# Altium schematic sheet Schematic.SchDoc
size C; SheetNumber: 1; SheetTotal: 1; SPICEModelCacheSRDWNHHB: <root> / <DocumentId>SRDWNHHB</DocumentId> / </root>
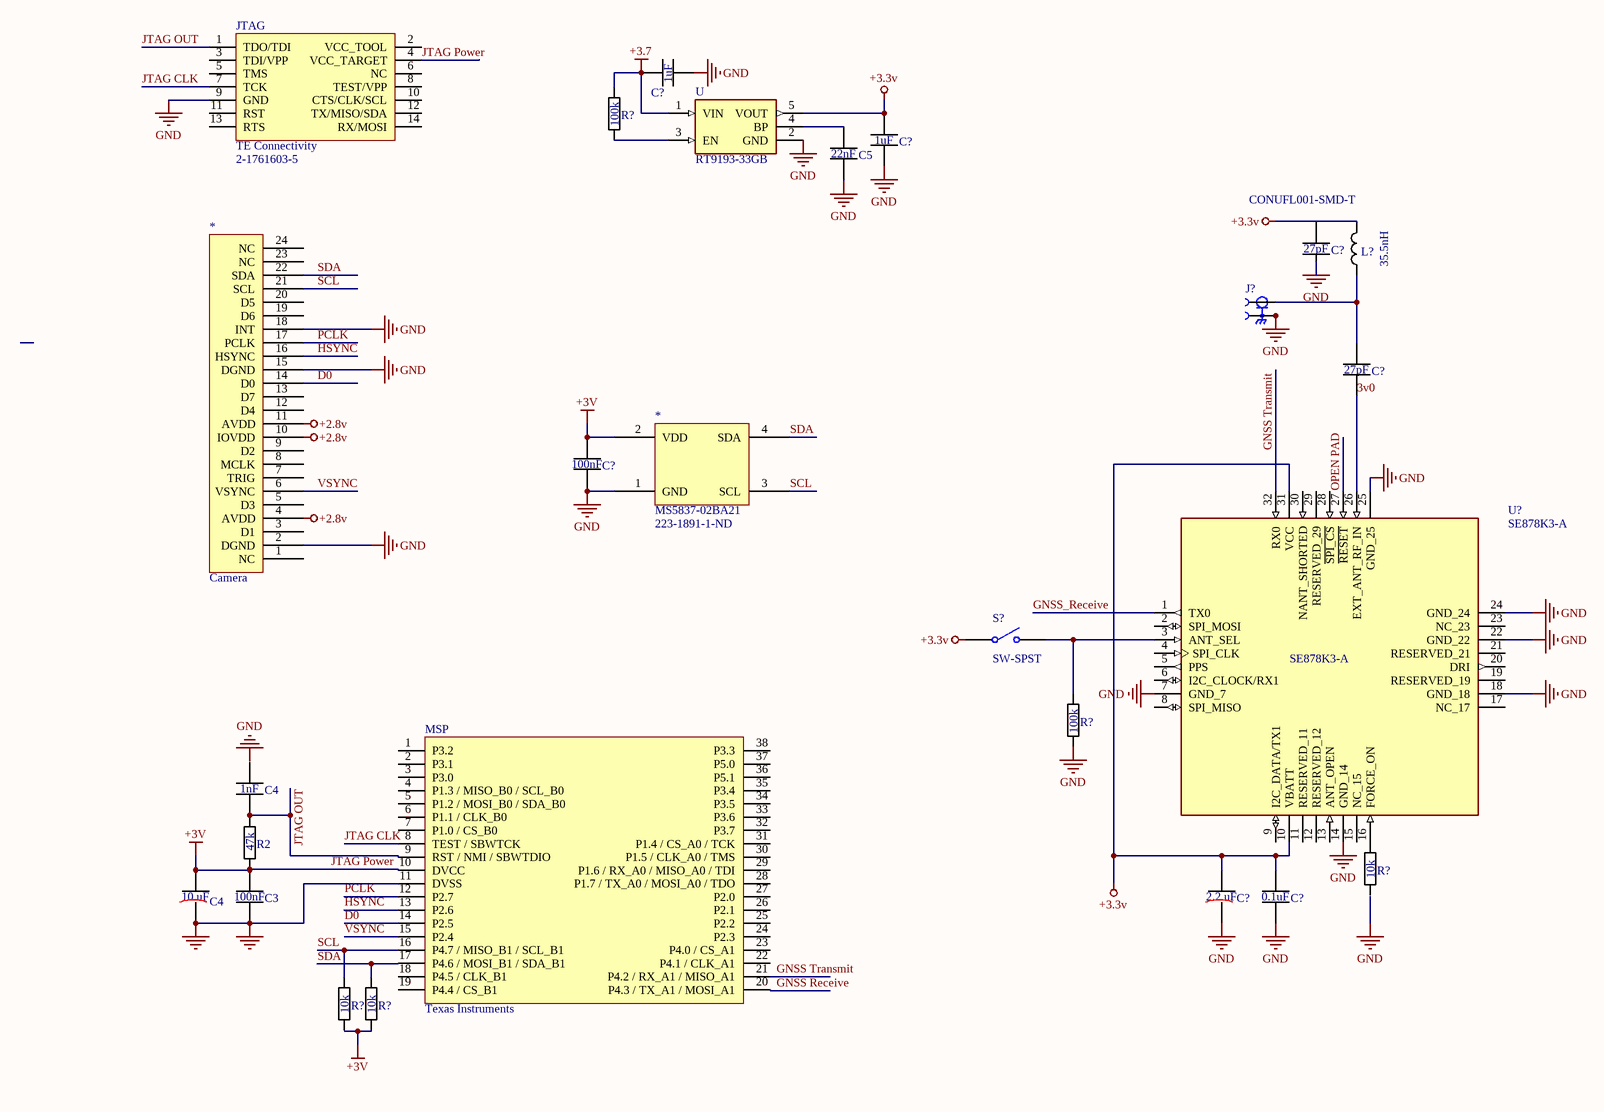
[diagram p0: Schematic.SchDoc]

## Parts
(Parts that share a designator on the sheet are numbered #1, #2 ... from top to bottom, then left to right.)
*#1  MS5837-02BA21  Supplier Part Number 1: 223-1891-1-ND
*#2  Camera
C3  value 100nF  [0805 (Capacitor)]  (hidden comment: C-u-002.200-10-0805)
C4#1  value 1nF  [0805 (Capacitor)]  (hidden comment: C-u-002.200-10-0805)
C4#2  value 10 uF  [0603 (Capacitor)]  (hidden comment: C-n-001.000-5-0603)
C5  value 22nF  [1210 (Capacitor)]  (hidden comment: C-u-022.000-10-1210)
C?#1  value 1uF  [0805 (Capacitor)]  (hidden comment: C-u-001.000-10-0805)
C?#2  value 1uF  [0805 (Capacitor)]  (hidden comment: C-u-001.000-10-0805)
C?#3  value 27pF  [0603 (Capacitor)]  (hidden comment: C-p-012.000-2-0603)
C?#4  value 27pF  [0603 (Capacitor)]  (hidden comment: C-p-012.000-2-0603)
C?#5  value 100nF  [0603 (Capacitor)]  (hidden comment: C-n-100.000-10-0603)
C?#6  value 2.2 uF  [0603 (Capacitor)]  (hidden comment: C-n-001.000-5-0603)
C?#7  value 0.1uF  [0805 (Capacitor)]  (hidden comment: C-u-002.200-10-0805)
J?  CONUFL001-SMD-T  [LINX_CONUFL001-SMD-T]
JTAG  Manufacturer: TE Connectivity  Manufucturer PartNo: 2-1761603-5  [TE 2-1761603-5]  (hidden comment: MSP430 Programming Header)
L?  value 35.5nH  [0805 (Inductor)]  (hidden comment: L-u-006.800-20-0603)
MSP  Manufacturer: Texas Instruments  [MSP430FR2355 38-TFSOP]  (hidden comment: MSP430FR2355 38-TFSOP)
R2  value 47k  [0603 (Resistor)]  (hidden comment: R-k-010.000-1-0603)
R?#1  value 100k  [0603 (Resistor)]  (hidden comment: R-k-100.000-1-0603)
R?#2  value 100k  [0603 (Resistor)]  (hidden comment: R-k-100.000-1-0603)
R?#3  value 10k  [0603 (Resistor)]  (hidden comment: R-k-010.000-1-0603)
R?#4  value 10k  [0603 (Resistor)]  (hidden comment: R-k-010.000-1-0603)
R?#5  value 10k  [0603 (Resistor)]  (hidden comment: R-k-010.000-1-0603)
S?  SW-SPST  [SPST-2]
U  RT9193-33GB  [SOT94P279X129-5N]
U?  SE878K3-A  [XCVR_SE878K3-A]

## Nets
+2.8v: *#2.4(AVDD) *#2.10(IOVDD) *#2.11(AVDD)
+3.3v: C?#2.1 C?#6.1 C?#7.1 L?.1 S?.1(COMMON) U.5(VOUT) U?.10(VBATT) U?.31(VCC)
+3.7: C?#1.1 R?#1.1 U.1(VIN)
GND: *#1.1(GND) *#2.2(DGND) *#2.15(DGND) *#2.18(INT) C5.2 C?#1.2 C?#2.2 C?#3.2 C?#5.2 C?#6.2 C?#7.2 J?.2 J?.3 JTAG.9(GND) R?#2.2 U.2(GND) U?.7(GND_7) U?.14(GND_14) U?.18(GND_18) U?.22(GND_22) U?.24(GND_24) U?.25(GND_25)
JTAG Power: *#1.2(VDD) C3.1 C4#2.1 C?#5.1 JTAG.4(VCC_TARGET) MSP.10(DVCC) R2.2 R?#5.2  [also labelled +3V]
VCC: C3.2 C4#2.2 MSP.11(DVSS)
3v0: C?#4.2 U?.26(EXT_ANT_RF_IN)
D0: *#2.14(D0) MSP.14(P2.5)
GNSS Receive: MSP.20(P4.3_/_TX_A1_/_MOSI_A1)
GNSS Transmit: MSP.21(P4.2_/_RX_A1_/_MISO_A1) U?.32(RX0)
GNSS_Receive: U?.1(TX0)
HSYNC: *#2.16(HSYNC) MSP.13(P2.6)
JTAG CLK: JTAG.7(TCK) MSP.8(TEST_/_SBWTCK)
JTAG OUT: C4#1.2 JTAG.1(TDO/TDI) MSP.9(RST_/_NMI_/_SBWTDIO) R2.1
OPEN PAD: U?.27(~{RESET})
PCLK: *#2.17(PCLK) MSP.12(P2.7)
SCL: *#1.3(SCL) *#2.21(SCL) MSP.16(P4.7_/_MISO_B1_/_SCL_B1) R?#4.1
SDA: *#1.4(SDA) *#2.22(SDA) MSP.17(P4.6_/_MOSI_B1_/_SDA_B1) R?#5.1
VSYNC: *#2.6(VSYNC) MSP.15(P2.4)
NetC5_1: C5.1 U.4(BP)
NetC?#4_1: C?#4.1 J?.1 L?.2
NetR?#1_2: R?#1.2 U.3(EN)
NetR?#2_1: R?#2.1 S?.2(NO) U?.3(ANT_SEL)
NetR?#3_1: R?#3.1 U?.16(FORCE_ON)

Not connected (* = marked no-connect by the designer): *#2 1(NC) 3(D1) 5(D3) 7(TRIG) 8(MCLK) 9(D2) 12(D4) 13(D7) 19(D6) 20(D5) 23(NC) 24(NC); C4#1 1; C?#3 1; JTAG 2(VCC_TOOL) 3(TDI/VPP) 5(TMS) 6(NC) 8(TEST/VPP) 10(CTS/CLK/SCL) 11(RST) 12(TX/MISO/SDA) 13(RTS) 14(RX/MOSI); MSP 1(P3.2) 2(P3.1) 3(P3.0) 4(P1.3_/_MISO_B0_/_SCL_B0) 5(P1.2_/_MOSI_B0_/_SDA_B0) 6(P1.1_/_CLK_B0) 7(P1.0_/_CS_B0) 18(P4.5_/_CLK_B1) 19(P4.4_/_CS_B1) 22(P4.1_/_CLK_A1) 23(P4.0_/_CS_A1) 24(P2.3) 25(P2.2) 26(P2.1) 27(P2.0) 28(P1.7_/_TX_A0_/_MOSI_A0_/_TDO) 29(P1.6_/_RX_A0_/_MISO_A0_/_TDI) 30(P1.5_/_CLK_A0_/_TMS) 31(P1.4_/_CS_A0_/_TCK) 32(P3.7) 33(P3.6) 34(P3.5) 35(P3.4) 36(P5.1) 37(P5.0) 38(P3.3); R?#3 2; R?#4 2; U? 2(SPI_MOSI) 4(SPI_CLK) 5(PPS) 6(I2C_CLOCK/RX1) 8(SPI_MISO) 9(I2C_DATA/TX1) 11(RESERVED_11) 12(RESERVED_12) 13(ANT_OPEN) 15(NC_15) 17(NC_17) 19(RESERVED_19) 20(DRI) 21(RESERVED_21) 23(NC_23) 28(~{SPI_CS}) 29(RESERVED_29) 30(NANT_SHORTED)

## Notes on the sheet
- Labels drawn without touching a wire or pin: GND

## Library data of the parts
*#1 = MS5837-02BA21: Pressure Sensor, Absolute, 2Bar, I2C; Manufacturer: TE Connectivity; Operating Pressure: 17.4PSI; Port Style: No Port; Max Pressure: 145.04PSI; Supplier 1: Digi-Key; Manufacturer Part Number: MS5837-02BA21; RoHS: No; Stock 1: 5173; Pricing 1: 1=12.98000, 5=11.38800, 10=10.24900, 25=9.11040, 50=8.42700, 100=7.28820, 500=6.83264, 1000=6.37714 (USD); Case/Package: SMD/SMT; Min Operating Temperature: -20°C; Max Operating Temperature: 85°C; Output Type: I2C; Pressure Type: Absolute; Termination: SMD/SMT; RoHS Compliant: Yes; ComponentLink1URL: https://www.te.com/commerce/DocumentDelivery/DDEController?Action=srchrtrv&amp;DocNm=MS5837-02BA01&amp;DocType=DS&amp;DocLang=English&src-supplier=Digi-Key; ComponentLink1Description: https://www.te.com/commerce/DocumentDelivery/DDEController?Action=srchrtrv&amp;DocNm=MS5837-02BA01&amp;DocType=DS&amp;DocLang=English&src-supplier=Digi-Key
*#2 = Component_1
C3 C4#1 = C-u-002.200-10-0805: Capacitor 2.2NF 0805 +/-10%; Manufacturer: Murata; Manufacturer PartNo: GCM21BR71E225KA73L; Case/Package: 0805; Tolerance: +/-10%
C4#2 C?#6 = C-n-001.000-5-0603: Capacitor 1nF 0603 +/-5%; Manufacturer: Murata; Manufacturer PartNo: GCM1885C2A102JA16D; Case/Package: 0603; Tolerance: +/-5%
C5 = C-u-022.000-10-1210: Capacitor 22uF 1210 +/-10%; Manufacturer: Murata Electronics; Manufacturer PartNo: GRM32ER71E226KE15L; Case/Package: 1210; Tolerance: +/-10%
C?#1 C?#2 = C-u-001.000-10-0805: Capacitor 1uF 0805 +/-10%; Manufacturer: Murata; Manufacturer PartNo: GCM21BR71H105KA03L; Case/Package: 0805; Tolerance: +/-10%
C?#3 C?#4 = C-p-012.000-2-0603: Capacitor 12pF 0603 +/-2%; Manufacturer: Murata; Manufacturer PartNo: GQM1875C2E120GB12D; Case/Package: 0603; Tolerance: +/-2%
C?#5 = C-n-100.000-10-0603: Capacitor 100nF 0603 +/-10%; Manufacturer: Murata; Manufacturer PartNo: GRM188R72A104KA35D; Case/Package: 0603; Tolerance: +/-10%
C?#7 = C-u-002.200-10-0805: Capacitor 2.2uF 0805 +/-10%; Manufacturer: Murata; Manufacturer PartNo: GCM21BR71E225KA73L; Case/Package: 0805; Tolerance: +/-10%
JTAG = MSP430 Programming Header: 14 Pin JTAG Header for MSP430 Debug Probe
L? = L-u-006.800-20-0603: Inductor 6.8uH 0805 +/-20%; Manufacturer: TDK; Manufacturer PartNo: MLZ2012N6R8LT000; Tolerance: +/-20%; Case/Package: 0805
MSP = MSP430FR2355 38-TFSOP: MSP430 Microcontroller
R2 R?#3-R?#5 = R-k-010.000-1-0603: Resistor 10k 0603 +/-1%; Manufacturer: Vishay Dale; Manufacturer PartNo: CRCW060310K0FKEAHP; Tolerance: +/-1%; Case/Package: 0603
R?#1 R?#2 = R-k-100.000-1-0603: Resistor 100k 0603 +/-1%; Manufacturer: Vishay Dale; Manufacturer PartNo: CRCW0603100KFKEAHP; Tolerance: +/-1%; Case/Package: 0603
S? = SW-SPST: Single-Pole, Single-Throw Switch; Published: 24-Mar-1999; LatestRevisionDate: 17-Jul-2002; LatestRevisionNote: Re-released for DXP Platform.; PackageReference: SPST-2; Publisher: Altium Limited; PackageDescription: Switch; 2 Leads
U = RT9193-33GB: Linear Voltage Regulator IC 1 Output 300mA SOT-23-5; MF: Richtek USA; Availability: Unavailable; MP: RT9193-33GB; Package: SOT-23-5 Richtek; SnapEDA_Link: https://www.snapeda.com/parts/RT9193-33GB/Richtek%20USA%20Inc./view-part/55570/?ref=snap; Value: *; Price: None
U? = SE878K3-A: GNSS L1 Antenna module (GPS, Galileo, Glonass, BeiDou); MF: Telit; SnapEDA_Link: https://www.snapeda.com/parts/SE878K3-A/Telit/view-part/?ref=snap; Value: *; Check_prices: https://www.snapeda.com/parts/SE878K3-A/Telit/view-part/?ref=eda; Availability: Not in stock; Price: None; MP: SE878K3-A; Package: NON-STANDARD-32 Telit
J? = CONUFL001-SMD-T: Availability: Unavailable; Package: None; MP: CONUFL001-SMD-T; Value: *; Price: None